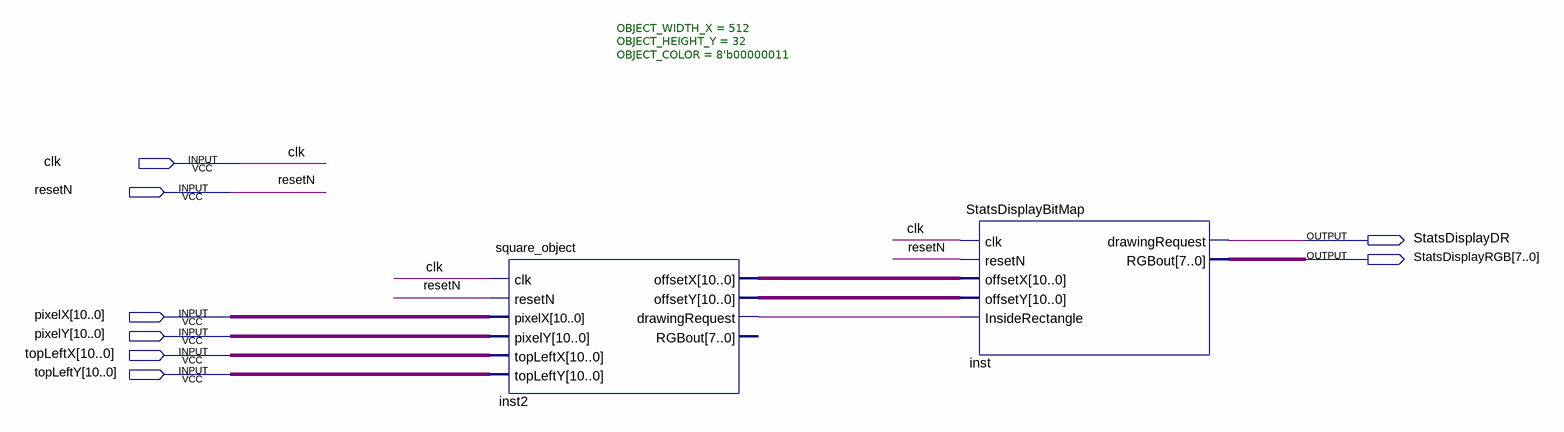
[diagram p0: schematic sheet]
// Quartus schematic StatsDisplayBlock.bdf as structural Verilog: 2 symbols, 8 pins
module StatsDisplayBlock (
  input  clk,
  input  resetN,
  input  [10:0] pixelX,
  input  [10:0] pixelY,
  input  [10:0] topLeftX,
  input  [10:0] topLeftY,
  output StatsDisplayDR,
  output [7:0] StatsDisplayRGB
);

  wire inst2_drawingrequest;
  wire [10:0] inst2_offsetx, inst2_offsety;

  square_object #(.OBJECT_WIDTH_X(512), .OBJECT_HEIGHT_Y(32), .OBJECT_COLOR(8'b00000011)) inst2 (
    .clk(clk), .resetN(resetN), .pixelX(pixelX), .pixelY(pixelY), .topLeftX(topLeftX), .topLeftY(topLeftY),
    .offsetX(inst2_offsetx), .offsetY(inst2_offsety), .drawingRequest(inst2_drawingrequest));  // open: RGBout
  StatsDisplayBitMap inst (
    .clk(clk), .resetN(resetN), .offsetX(inst2_offsetx), .offsetY(inst2_offsety),
    .InsideRectangle(inst2_drawingrequest), .drawingRequest(StatsDisplayDR), .RGBout(StatsDisplayRGB));
endmodule
